# Altium schematic sheet Audio_Module.SchDoc: Audio Module
size A4; DocumentNumber: 4; SheetNumber: 4; SheetTotal: 31
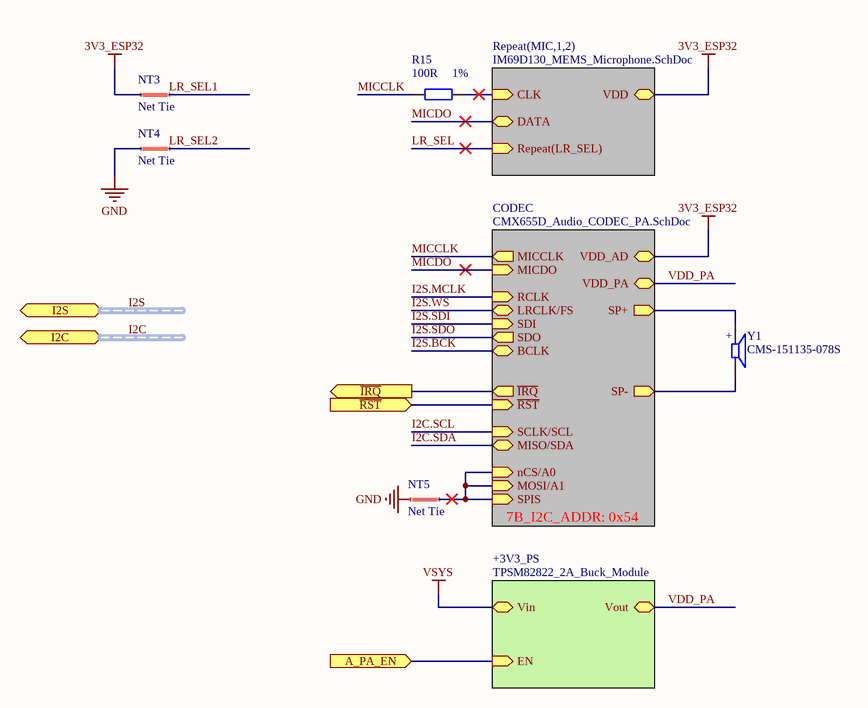
[diagram p0: Audio_Module.SchDoc]

## Parts
NT3  Net Tie  [Net Tie 6x30mil]  (net tie, no BOM)
NT4  Net Tie  [Net Tie 6x30mil]  (net tie, no BOM)
NT5  Net Tie  [Net Tie 6x30mil]  (net tie, no BOM)
R15  Tolerance: 1%  Resistance: 100R  [0402R]  (hidden comment: RES SMD 100 OHM 1% 1/16W 0402)
Y1  CMS-151135-078S  [SPKR_CMS-151135-078S]

## Sub-sheets
+3V3_PS = TPSM82822_2A_Buck_Module: Vout, Vin, EN (in)
CODEC = CMX655D_Audio_CODEC_PA.SchDoc: SP+ (out), SP- (out), VDD_AD, VDD_PA, MICCLK (out), MICDO (in), ~{IRQ} (out), ~{RST} (in), SCLK/SCL (in), MISO/SDA (bidir), MOSI/A1 (in), nCS/A0 (in), SPIS (in), RCLK (in), LRCLK/FS (bidir), SDI (in), SDO (out), BCLK (bidir)  | 7B_I2C_ADDR: 0x54
Repeat(MIC,1,2) = IM69D130_MEMS_Microphone.SchDoc: CLK (in), DATA, VDD, Repeat(LR_SEL) (in)

## Ports
A_PA_EN (in), I2C (harness I2C), I2S (harness I2S), ~{IRQ} (out), ~{RST} (in)

## Nets
3V3_ESP32: NT3.1 ; sheet Repeat(MIC,1,2)/VDD, sheet CODEC/VDD_AD
GND: NT4.1 NT5.1
VSYS: sheet +3V3_PS/Vin
~{IRQ}: port ~{IRQ}, sheet CODEC/~{IRQ}
~{RST}: port ~{RST}, sheet CODEC/~{RST}
A_PA_EN: port A_PA_EN, sheet +3V3_PS/EN
I2C.SCL: sheet CODEC/SCLK/SCL
I2C.SDA: sheet CODEC/MISO/SDA
I2S.BCK: sheet CODEC/BCLK
I2S.MCLK: sheet CODEC/RCLK
I2S.SDI: sheet CODEC/SDI
I2S.SDO: sheet CODEC/SDO
I2S.WS: sheet CODEC/LRCLK/FS
LR_SEL: sheet Repeat(MIC,1,2)/Repeat(LR_SEL)
LR_SEL1: NT3.2
LR_SEL2: NT4.2
MICCLK: R15.2 ; sheet CODEC/MICCLK
MICDO: sheet Repeat(MIC,1,2)/DATA, sheet CODEC/MICDO
VDD_PA: sheet CODEC/VDD_PA, sheet +3V3_PS/Vout
NetNT5_2: NT5.2 ; sheet CODEC/MOSI/A1, sheet CODEC/nCS/A0, sheet CODEC/SPIS
NetR15_1: R15.1 ; sheet Repeat(MIC,1,2)/CLK
NetY1_M: Y1.M ; sheet CODEC/SP-
NetY1_P: Y1.P ; sheet CODEC/SP+

## Buses and harness runs
harness I2C = port I2C
harness I2S = port I2S

## Notes on the sheet
- Title
- Size:
- Date:
- A4
- Number:
- Time:
- Revision:
- Sheet
- of
- File:
- (in symbol SPEAKER CMS-151135-078S 15 X 11 MM ENCLOSED) +

## Library data of the parts
NT3-NT5 = Net Tie Line: ClassName: Net Tie
R15 = RES SMD 100 OHM 1% 1/16W 0402: 100 Ohms ±1% 0.063W, 1/16W Chip Resistor 0402 (1005 Metric) Moisture Resistant Thick Film; Manufacturer: Yageo; Manufacturer Part Number: RC0402FR-07100RL; Power Rating: 62.5mW; Voltage Rating: 50V; Temperature Coefficient: 100ppm/°C; Supplier 1: Digi-Key; Stock 1: 16989760; Pricing 1: 1=0.1, 10=0.016, 100=0.0064, 1000=0.0029, 2500=0.0025, 5000=0.0021 (USD); Case/Package: 0402; Number of Pins: 2; Case Code (Imperial): 0402; Case Code (Metric): 1005; Min Operating Temperature: -55°C; Max Operating Temperature: 155°C; Voltage Rating (DC): 50V; Packaging: Tape and Reel; Termination: SMD/SMT; Composition: Thick Film; Military Standard: Not; Length: 1mm; Height: 0.32mm; Width: 0.5mm; Depth: 0.5mm; REACH SVHC: No SVHC; Lead Free: Lead Free; ComponentLink1URL: http://www.farnell.com/datasheets/2167052.pdf?src-supplier=Element14; ComponentLink1Description: http://www.farnell.com/datasheets/2167052.pdf?src-supplier=Element14; ComponentLink2URL: http://www.yageo.com/documents/recent/PYu-RC_Group_51_RoHS_L_9.pdf?src-supplier=Mouser; ComponentLink2Description: http://www.yageo.com/documents/recent/PYu-RC_Group_51_RoHS_L_9.pdf?src-supplier=Mouser; ComponentLink3URL: http://www.yageo.com/documents/recent/PYu-RC0402_51_RoHS_L_6_r.pdf?src-supplier=Future+Electronics; ComponentLink3Description: http://www.yageo.com/documents/recent/PYu-RC0402_51_RoHS_L_6_r.pdf?src-supplier=Future+Electronics; ComponentLink4URL: https://www.verical.com/server-webapp/html/getDatasheet?partID=329466&src-supplier=Verical; ComponentLink4Description: https://www.verical.com/server-webapp/html/getDatasheet?partID=329466&src-supplier=Verical; ComponentLink5URL: http://www.farnell.com/datasheets/1018594.pdf?src-supplier=Element14; ComponentLink5Description: http://www.farnell.com/datasheets/1018594.pdf?src-supplier=Element14; ComponentLink6URL: http://documents.rs-components.com/techlib://itc_doclist_GB.htm?stockno=6185810&src-supplier=RSComponents; ComponentLink6Description: http://documents.rs-components.com/techlib://itc_doclist_GB.htm?stockno=6185810&src-supplier=RSComponents; Supplier Part Number 1: 311-100LRDKR-ND
Y1 = SPEAKER CMS-151135-078S 15 X 11 MM ENCLOSED: 8 Ohms General Purpose Speaker 700mW 100Hz ~ 20kHz Top Rectangular; Manufacturer: CUI; Sensing Method: Magnetic; Self Resonant Frequency: 550Hz; Impedance: 8R; Max Power Dissipation: 1W; Supplier 1: Digi-Key; Manufacturer Part Number: CMS-151135-078S; Stock 1: 1971; Pricing 1: 1=2.07, 10=1.72, 25=1.5888, 50=1.4932, 100=1.4013, 500=1.2016, 1000=1.17 (USD); Packaging: Tray; ComponentLink1URL: https://www.cui.com/product/resource/digikeypdf/CMS-15113-078x.pdf?src-supplier=Digi-Key; ComponentLink1Description: https://www.cui.com/product/resource/digikeypdf/CMS-15113-078x.pdf?src-supplier=Digi-Key; Supplier Part Number 1: 102-4616-ND; Shape: Rectangular; Type: General Purpose; Power Rating: 700mW